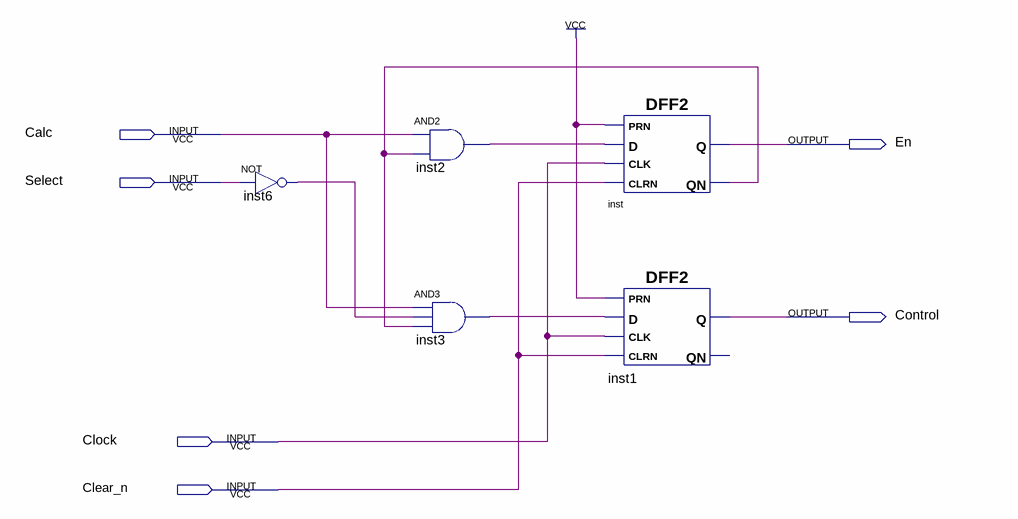
[diagram p0: schematic sheet]
// Quartus schematic SelectionFSM1.bdf as structural Verilog: 5 symbols, 6 pins
module SelectionFSM1 (
  input  Calc,
  input  Select,
  input  Clock,
  input  Clear_n,
  output En,
  output Control
);

  wire inst2_out, inst3_out, inst6_out, inst_qn;

  not inst6 (inst6_out, Select);
  and inst2 (inst2_out, Calc, inst_qn);
  and inst3 (inst3_out, Calc, inst6_out, inst_qn);
  DFF2 inst (.CLK(Clock), .D(inst2_out), .PRN(1'b1), .CLRN(Clear_n), .Q(En), .QN(inst_qn));
  DFF2 inst1 (.CLK(Clock), .D(inst3_out), .PRN(1'b1), .CLRN(Clear_n), .Q(Control));  // open: QN
endmodule
